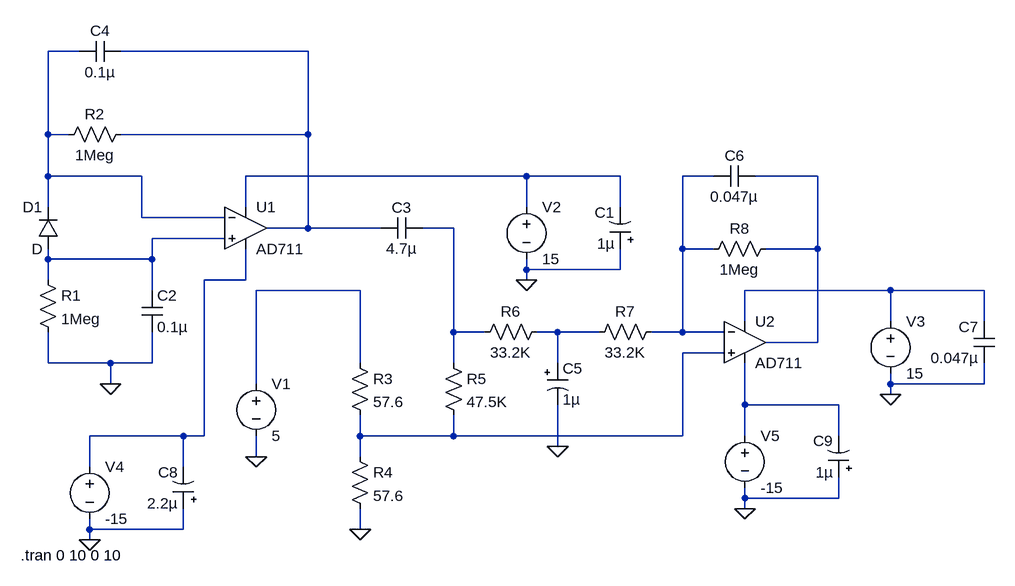
[diagram p0: schematic sensor_circuits.asc]
sensor_circuits.asc, the LTspice schematic file:
Version 4
SHEET 1 2084 680
WIRE 592 -784 544 -784
WIRE 944 -784 656 -784
WIRE 544 -656 544 -784
WIRE 576 -656 544 -656
WIRE 944 -656 944 -784
WIRE 944 -656 656 -656
WIRE 544 -592 544 -656
WIRE 688 -592 544 -592
WIRE 1280 -592 848 -592
WIRE 1424 -592 1280 -592
WIRE 1568 -592 1520 -592
WIRE 1728 -592 1632 -592
WIRE 544 -544 544 -592
WIRE 848 -544 848 -592
WIRE 1280 -544 1280 -592
WIRE 1424 -544 1424 -592
WIRE 688 -528 688 -592
WIRE 816 -528 688 -528
WIRE 944 -512 944 -656
WIRE 944 -512 880 -512
WIRE 1056 -512 944 -512
WIRE 1168 -512 1120 -512
WIRE 816 -496 704 -496
WIRE 1520 -480 1520 -592
WIRE 1568 -480 1520 -480
WIRE 1728 -480 1728 -592
WIRE 1728 -480 1648 -480
WIRE 544 -464 544 -480
WIRE 704 -464 704 -496
WIRE 704 -464 544 -464
WIRE 1280 -448 1280 -464
WIRE 1424 -448 1424 -480
WIRE 1424 -448 1280 -448
WIRE 544 -432 544 -464
WIRE 848 -432 848 -480
WIRE 848 -432 784 -432
WIRE 1280 -432 1280 -448
WIRE 704 -416 704 -464
WIRE 1024 -416 864 -416
WIRE 1840 -416 1616 -416
WIRE 1984 -416 1840 -416
WIRE 1616 -368 1616 -416
WIRE 1840 -368 1840 -416
WIRE 1984 -368 1984 -416
WIRE 1168 -352 1168 -512
WIRE 1216 -352 1168 -352
WIRE 1328 -352 1296 -352
WIRE 1392 -352 1328 -352
WIRE 1520 -352 1520 -480
WIRE 1520 -352 1472 -352
WIRE 1584 -352 1520 -352
WIRE 1728 -336 1728 -480
WIRE 1728 -336 1648 -336
WIRE 1584 -320 1520 -320
WIRE 544 -304 544 -352
WIRE 640 -304 544 -304
WIRE 704 -304 704 -352
WIRE 704 -304 640 -304
WIRE 1024 -304 1024 -416
WIRE 1168 -304 1168 -352
WIRE 1328 -304 1328 -352
WIRE 640 -272 640 -304
WIRE 864 -272 864 -416
WIRE 1840 -272 1840 -288
WIRE 1984 -272 1984 -304
WIRE 1984 -272 1840 -272
WIRE 1840 -256 1840 -272
WIRE 1616 -240 1616 -304
WIRE 1760 -240 1616 -240
WIRE 752 -192 608 -192
WIRE 784 -192 784 -432
WIRE 784 -192 752 -192
WIRE 1024 -192 1024 -224
WIRE 1168 -192 1168 -224
WIRE 1168 -192 1024 -192
WIRE 1520 -192 1520 -320
WIRE 1520 -192 1168 -192
WIRE 1616 -192 1616 -240
WIRE 1760 -192 1760 -240
WIRE 1328 -176 1328 -240
WIRE 864 -160 864 -192
WIRE 1024 -160 1024 -192
WIRE 608 -144 608 -192
WIRE 752 -144 752 -192
WIRE 1616 -96 1616 -112
WIRE 1760 -96 1760 -128
WIRE 1760 -96 1616 -96
WIRE 1616 -80 1616 -96
WIRE 608 -48 608 -64
WIRE 752 -48 752 -80
WIRE 752 -48 608 -48
WIRE 1024 -48 1024 -80
WIRE 608 -32 608 -48
FLAG 640 -272 0
FLAG 864 -160 0
FLAG 1024 -48 0
FLAG 1328 -176 0
FLAG 1280 -432 0
FLAG 1840 -256 0
FLAG 608 -32 0
FLAG 1616 -80 0
SYMBOL res 528 -448 R0
SYMATTR InstName R1
SYMATTR Value 1Meg
SYMATTR SpiceLine tol=1 pwr=0.1
SYMBOL diode 560 -480 R180
WINDOW 0 24 64 Left 2
WINDOW 3 24 0 Left 2
SYMATTR InstName D1
SYMBOL res 672 -672 R90
WINDOW 0 0 56 VBottom 2
WINDOW 3 32 56 VTop 2
SYMATTR InstName R2
SYMATTR Value 1Meg
SYMATTR SpiceLine tol=1 pwr=0.1
SYMBOL cap 688 -416 R0
SYMATTR InstName C2
SYMATTR Value 0.1µ
SYMATTR SpiceLine V=6.3 Irms=2.1 Rser=0.0606238 Lser=0 mfg="KEMET" pn="C1210C104K9RAC" type="X7R"
SYMBOL cap 656 -800 R90
WINDOW 0 0 32 VBottom 2
WINDOW 3 32 32 VTop 2
SYMATTR InstName C4
SYMATTR Value 0.1µ
SYMATTR SpiceLine V=16 Irms=4.39 Rser=0.0357547 Lser=0 mfg="KEMET" pn="C0402C104K4RAC" type="X7R"
SYMBOL voltage 864 -288 R0
WINDOW 123 0 0 Left 0
WINDOW 39 0 0 Left 0
SYMATTR InstName V1
SYMATTR Value 5
SYMBOL res 1008 -320 R0
SYMATTR InstName R3
SYMATTR Value 57.6
SYMATTR SpiceLine tol=1 pwr=0.1
SYMBOL res 1008 -176 R0
SYMATTR InstName R4
SYMATTR Value 57.6
SYMATTR SpiceLine tol=1 pwr=0.1
SYMBOL res 1152 -320 R0
SYMATTR InstName R5
SYMATTR Value 47.5K
SYMATTR SpiceLine tol=1 pwr=0.1
SYMBOL cap 1120 -528 R90
WINDOW 0 0 32 VBottom 2
WINDOW 3 32 32 VTop 2
SYMATTR InstName C3
SYMATTR Value 4.7µ
SYMATTR SpiceLine V=10 Irms=0 Rser=0.0061 Lser=518p mfg="Würth Elektronik" pn="885012108008 WCAP-CSGP 1206" type="X5R"
SYMBOL res 1312 -368 R90
WINDOW 0 0 56 VBottom 2
WINDOW 3 32 56 VTop 2
SYMATTR InstName R6
SYMATTR Value 33.2K
SYMATTR SpiceLine tol=1 pwr=0.1
SYMBOL polcap 1312 -304 R0
WINDOW 3 24 56 Left 2
SYMATTR InstName C5
SYMATTR Value 1µ
SYMATTR Description Capacitor
SYMATTR Type cap
SYMATTR SpiceLine V=16 Irms=0 Rser=11 Lser=0 mfg="AVX" pn="TAJA105K016" type="Tantalum"
SYMBOL res 1488 -368 R90
WINDOW 0 0 56 VBottom 2
WINDOW 3 32 56 VTop 2
SYMATTR InstName R7
SYMATTR Value 33.2K
SYMATTR SpiceLine tol=1 pwr=0.1
SYMBOL res 1664 -496 R90
WINDOW 0 0 56 VBottom 2
WINDOW 3 32 56 VTop 2
SYMATTR InstName R8
SYMATTR Value 1Meg
SYMATTR SpiceLine tol=1 pwr=0.1
SYMBOL cap 1632 -608 R90
WINDOW 0 0 32 VBottom 2
WINDOW 3 32 32 VTop 2
SYMATTR InstName C6
SYMATTR Value 0.047µ
SYMATTR SpiceLine V=10 Irms=1.73 Rser=0.111904 Lser=0 mfg="KEMET" pn="C0402C473K8RAC" type="X7R"
SYMBOL OpAmps\\AD711 848 -576 R0
SYMATTR InstName U1
SYMBOL OpAmps\\AD711 1616 -400 R0
SYMATTR InstName U2
SYMBOL voltage 1280 -560 R0
WINDOW 123 0 0 Left 0
WINDOW 39 0 0 Left 0
SYMATTR InstName V2
SYMATTR Value 15
SYMBOL polcap 1440 -480 R180
WINDOW 0 24 56 Left 2
WINDOW 3 24 8 Left 2
SYMATTR InstName C1
SYMATTR Value 1µ
SYMATTR Description Capacitor
SYMATTR Type cap
SYMATTR SpiceLine V=16 Irms=0 Rser=11 Lser=0 mfg="AVX" pn="TAJA105K016" type="Tantalum"
SYMBOL cap 2000 -304 R180
WINDOW 0 24 56 Left 2
WINDOW 3 24 8 Left 2
SYMATTR InstName C7
SYMATTR Value 0.047µ
SYMATTR SpiceLine V=6.3 Irms=1.2 Rser=0.111904 Lser=0 mfg="KEMET" pn="C0402C473K9RAC" type="X7R"
SYMBOL voltage 608 -160 R0
WINDOW 123 0 0 Left 0
WINDOW 39 0 0 Left 0
SYMATTR InstName V4
SYMATTR Value -15
SYMBOL polcap 768 -80 R180
WINDOW 0 24 56 Left 2
WINDOW 3 24 8 Left 2
SYMATTR InstName C8
SYMATTR Value 2.2µ
SYMATTR Description Capacitor
SYMATTR Type cap
SYMATTR SpiceLine V=16 Irms=0 Rser=6.5 Lser=0 mfg="AVX" pn="TAJA225K016" type="Tantalum"
SYMBOL voltage 1616 -208 R0
WINDOW 123 0 0 Left 0
WINDOW 39 0 0 Left 0
SYMATTR InstName V5
SYMATTR Value -15
SYMBOL polcap 1776 -128 R180
WINDOW 0 24 56 Left 2
WINDOW 3 24 8 Left 2
SYMATTR InstName C9
SYMATTR Value 1µ
SYMATTR Description Capacitor
SYMATTR Type cap
SYMATTR SpiceLine V=16 Irms=0 Rser=11 Lser=0 mfg="AVX" pn="TAJA105K016" type="Tantalum"
SYMBOL voltage 1840 -384 R0
WINDOW 123 0 0 Left 0
WINDOW 39 0 0 Left 0
SYMATTR InstName V3
SYMATTR Value 15
TEXT 502 -8 Left 2 !.tran 0 10 0 10

The netlist it stands for:
* sensor_circuits.asc
R1 N007 0 1Meg tol=1 pwr=0.1
D1 N007 N001 D
R2 N002 N001 1Meg tol=1 pwr=0.1
C2 N007 0 0.1µ V=6.3 Irms=2.1 Rser=0.0606238 Lser=0 mfg="KEMET" pn="C1210C104K9RAC" type="X7R"
C4 N002 N001 0.1µ V=16 Irms=4.39 Rser=0.0357547 Lser=0 mfg="KEMET" pn="C0402C104K4RAC" type="X7R"
V1 N009 0 5
R3 N009 N012 57.6 tol=1 pwr=0.1
R4 N012 0 57.6 tol=1 pwr=0.1
R5 N006 N012 47.5K tol=1 pwr=0.1
C3 N006 N002 4.7µ V=10 Irms=0 Rser=0.0061 Lser=518p mfg="Würth Elektronik" pn="885012108008 WCAP-CSGP 1206" type="X5R"
R6 N011 N006 33.2K tol=1 pwr=0.1
C5 N011 0 1µ V=16 Irms=0 Rser=11 Lser=0 mfg="AVX" pn="TAJA105K016" type="Tantalum"
R7 N004 N011 33.2K tol=1 pwr=0.1
R8 N005 N004 1Meg tol=1 pwr=0.1
C6 N005 N004 0.047µ V=10 Irms=1.73 Rser=0.111904 Lser=0 mfg="KEMET" pn="C0402C473K8RAC" type="X7R"
XU1 N007 N001 N003 N008 N002 AD712  ; AD711, pins In+ In- V+ V- OUT
XU2 N012 N004 N010 N013 N005 AD712  ; AD711, pins In+ In- V+ V- OUT
V2 N003 0 15
C1 0 N003 1µ V=16 Irms=0 Rser=11 Lser=0 mfg="AVX" pn="TAJA105K016" type="Tantalum"
C7 0 N010 0.047µ V=6.3 Irms=1.2 Rser=0.111904 Lser=0 mfg="KEMET" pn="C0402C473K9RAC" type="X7R"
V4 N008 0 -15
C8 0 N008 2.2µ V=16 Irms=0 Rser=6.5 Lser=0 mfg="AVX" pn="TAJA225K016" type="Tantalum"
V5 N013 0 -15
C9 0 N013 1µ V=16 Irms=0 Rser=11 Lser=0 mfg="AVX" pn="TAJA105K016" type="Tantalum"
V3 N010 0 15
.model D D
.lib standard.dio
.tran 0 10 0 10
.lib ADI1.lib
.backanno
.end